# EAGLE design sensorfix (EAGLE 7.1.0)
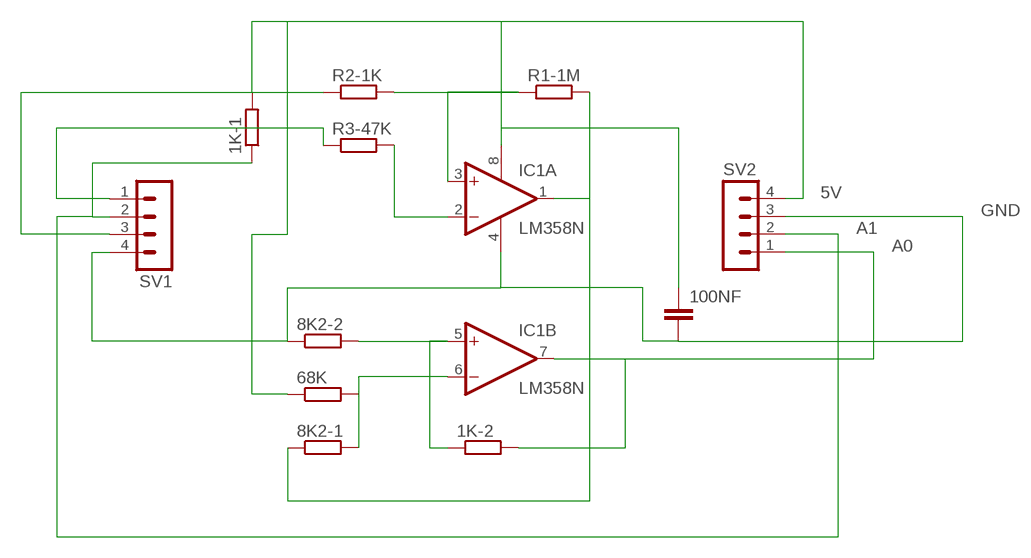
[diagram p0: schematic, sheet 1]

## Parts
1K-1  R-EU_0309/12  [0309/12]
1K-2  R-EU_0309/12  [0309/12]
8K2-1  R-EU_0309/12  [0309/12]
8K2-2  R-EU_0309/12  [0309/12]
68K  R-EU_0309/12  [0309/12]
100NF  C2.5/6  [C2.5-6]
IC1  LM358N  [DIL08]
R1-1M  R-EU_0309/12  [0309/12]
R2-1K  R-EU_0309/12  [0309/12]
R3-47K  R-EU_0309/12  [0309/12]
SV1  MA04-1  [MA04-1]
SV2  MA04-1  [MA04-1]

## Nets
5V: 1K-1.2 68K.1 100NF.1 IC1.8(P:V+) SV2.4
A0: 1K-2.2 IC1.7(B:OUT) SV2.1
A1: 1K-1.1 SV1.2 SV2.2
GND: 8K2-2.1 100NF.2 IC1.4(P:V-) SV1.4 SV2.3
N$1: IC1.3(A:+IN) R1-1M.1 R2-1K.2
N$2: 8K2-1.1 IC1.1(A:OUT) R1-1M.2
N$3: IC1.2(A:-IN) R3-47K.2
N$4: 1K-2.1 8K2-2.2 IC1.5(B:+IN)
N$5: 8K2-1.2 68K.2 IC1.6(B:-IN)
N$7: R3-47K.1 SV1.1
N$8: R2-1K.1 SV1.3

## Library data of the parts
1K-1 1K-2 8K2-1 8K2-2 68K R1-1M R2-1K R3-47K = rcl:R-EU_: RESISTOR, European symbol
100NF = capacitor-wima:C: CAPACITOR naming: grid - package width
IC1 = linear:LM358: OP AMP also LM158; LM258; LM2904 Source: http://cache.national.com/ds/LM/LM158.pdf
SV1 SV2 = con-lstb:MA04-1: PIN HEADER; OC_FARNELL: unknown; OC_NEWARK: unknown

## Board
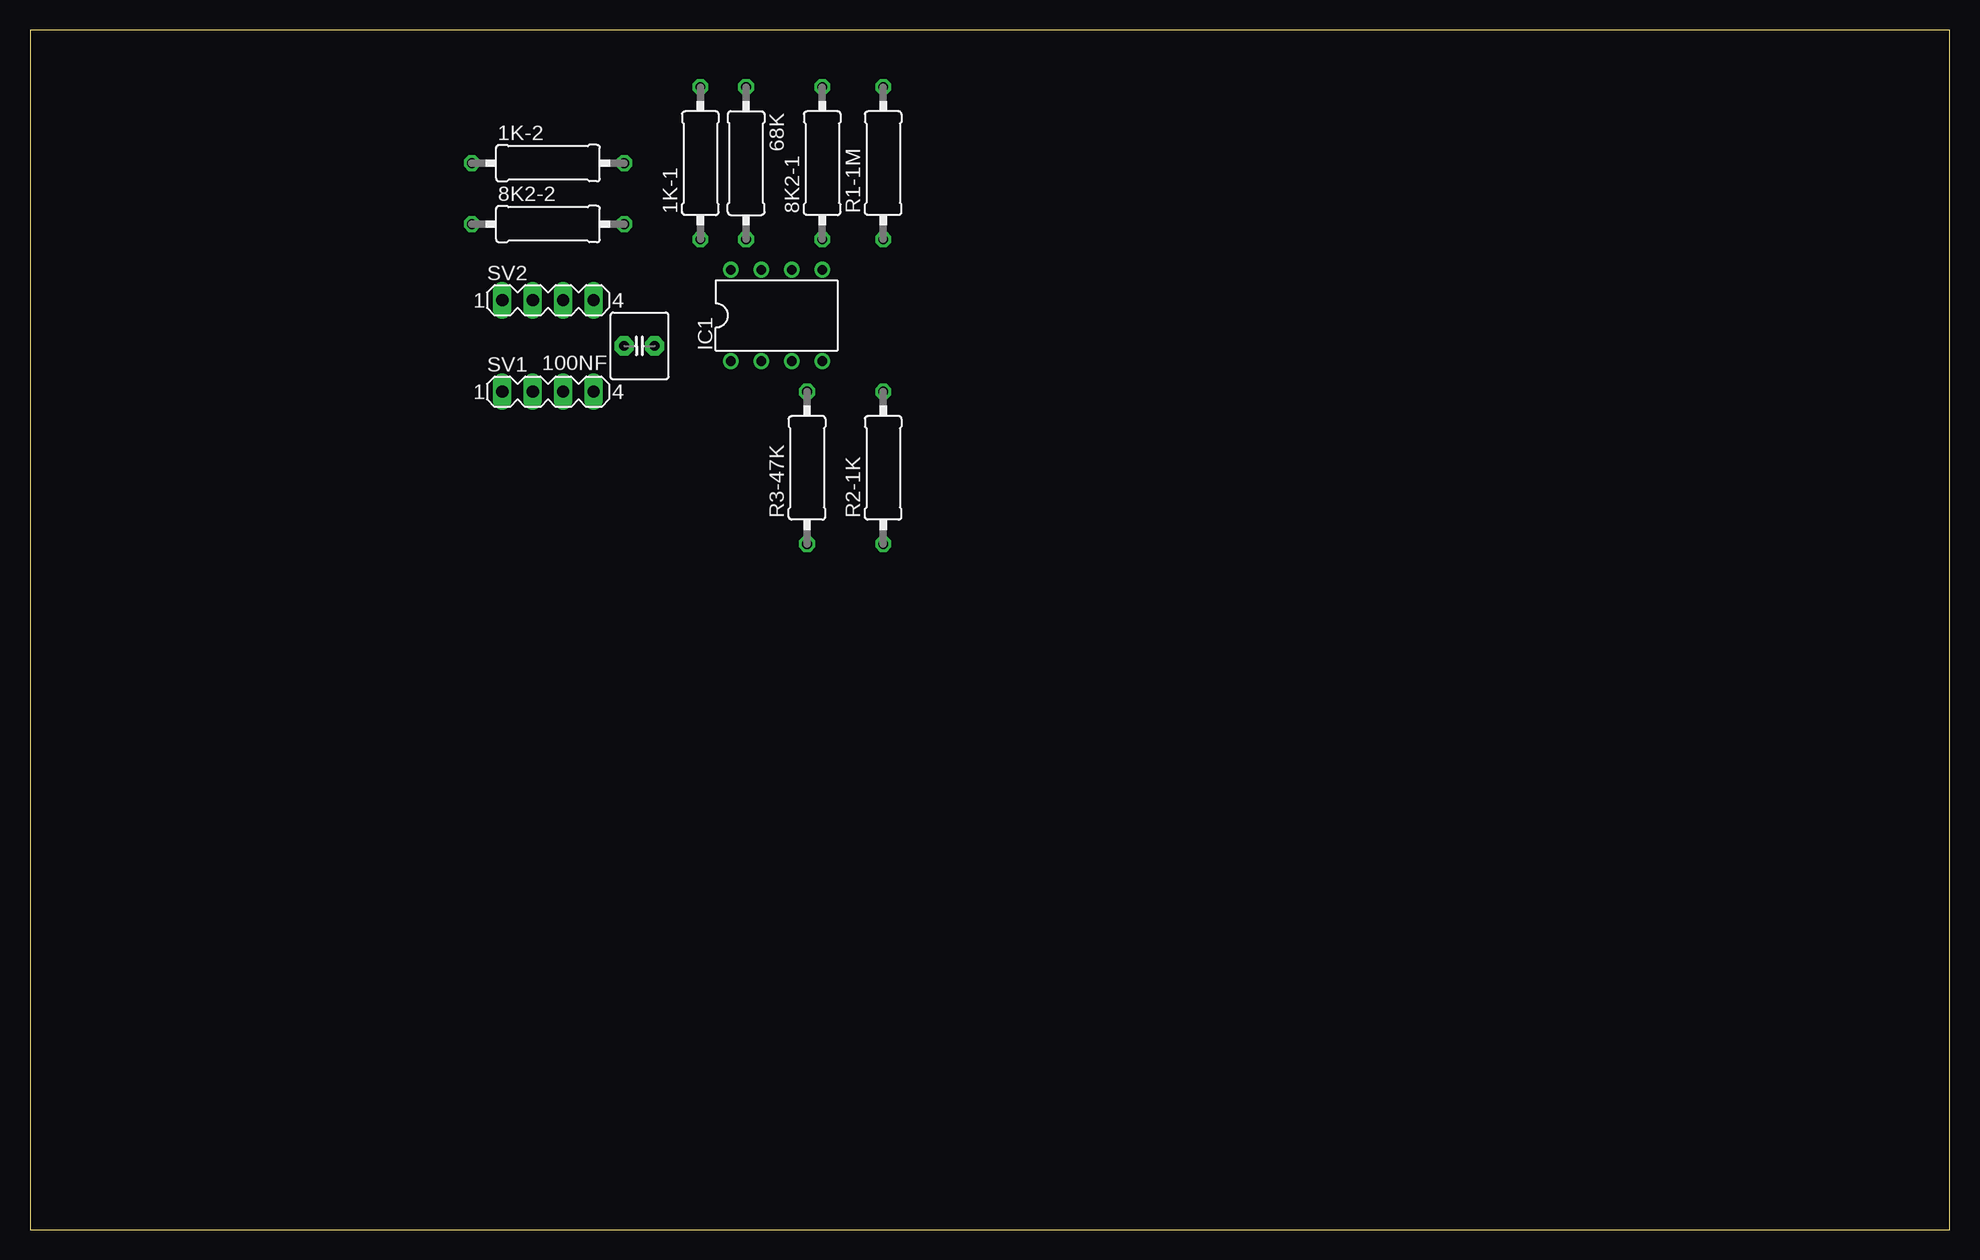
[diagram p1: board, top side]
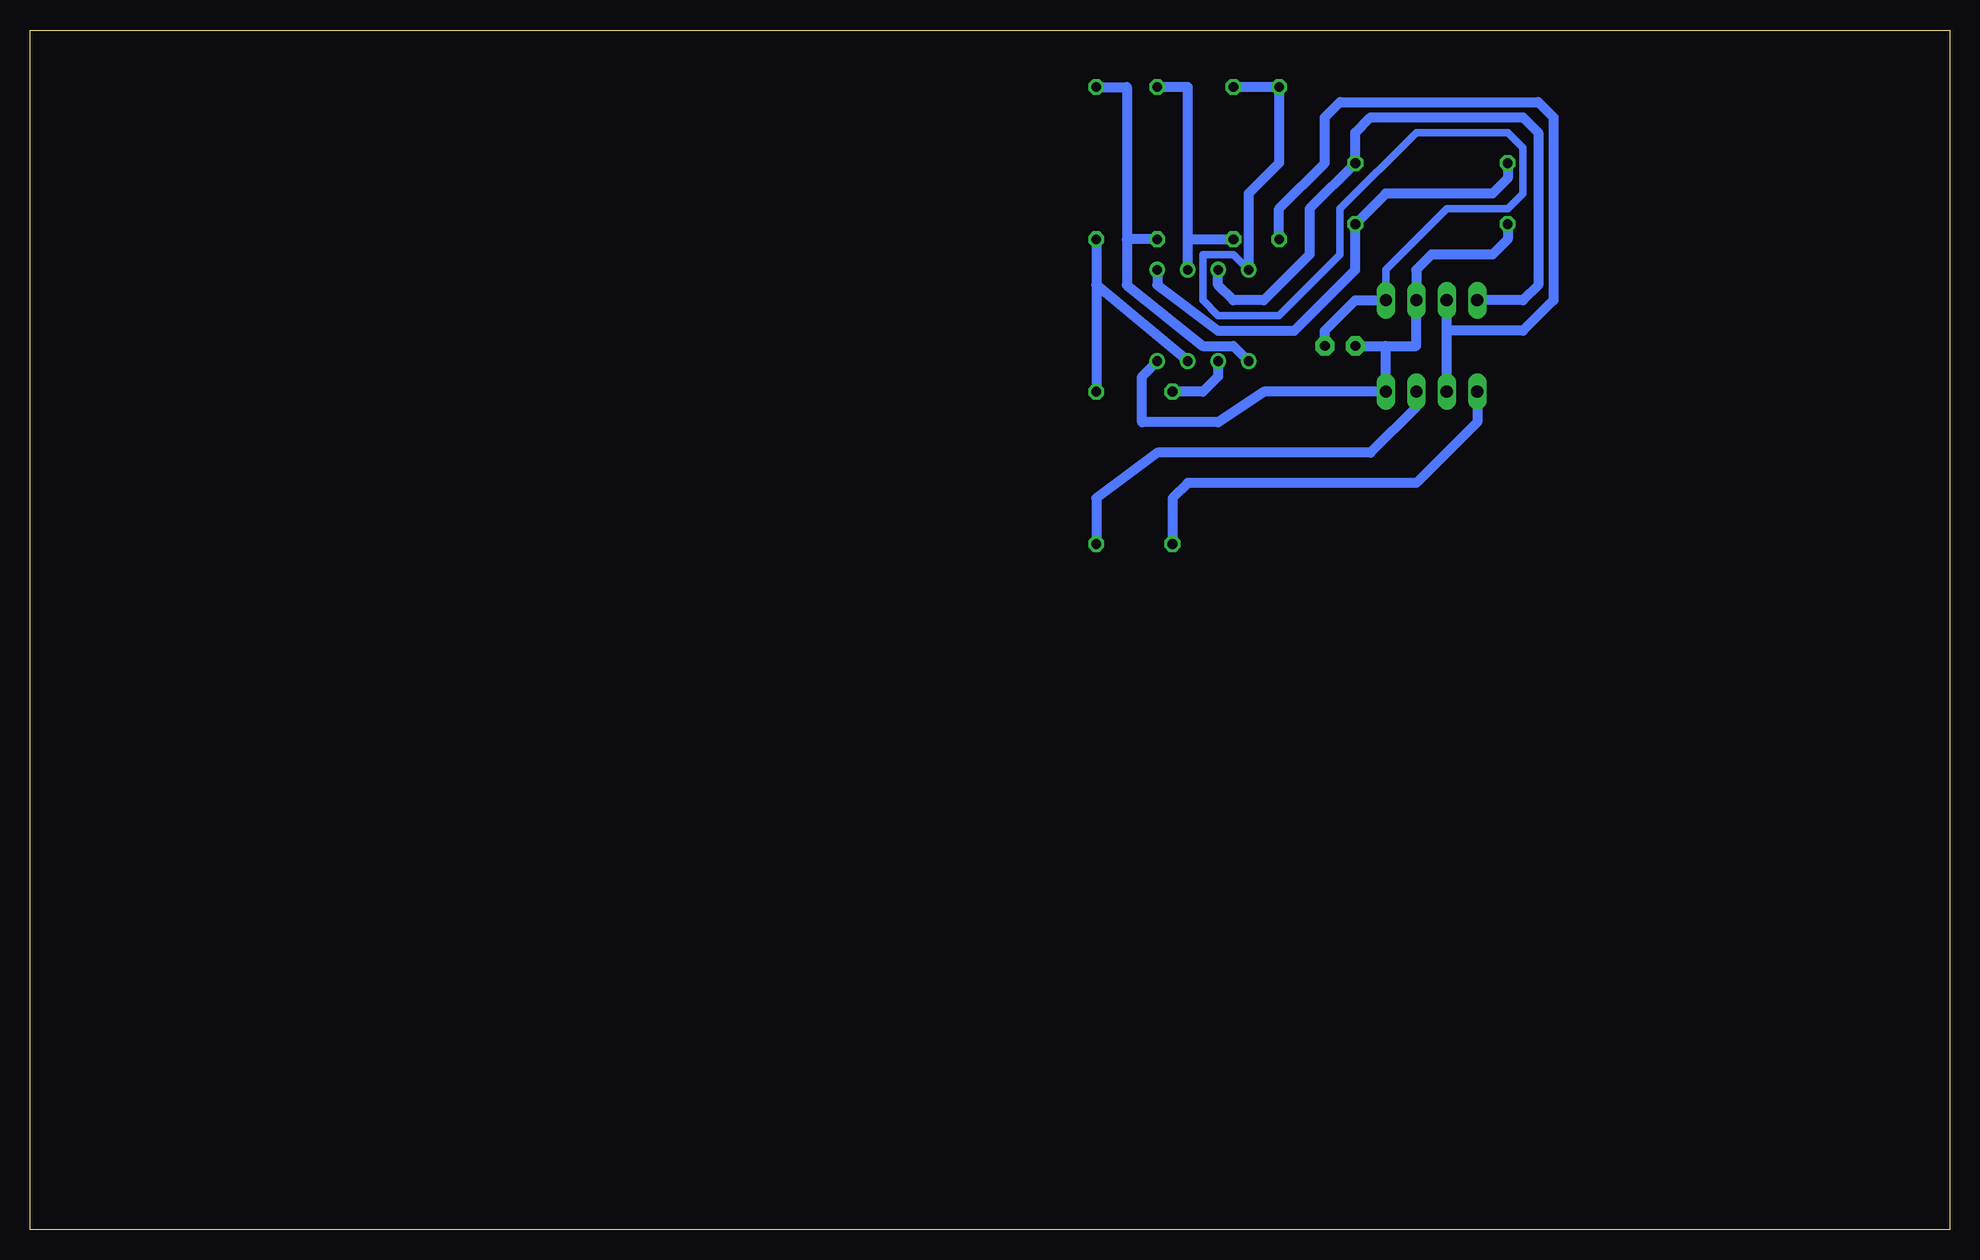
[diagram p2: board, bottom side, seen from below]

Size 160 x 100 mm. Coordinates in mm from the lower left corner, seen from the top.
Outline: 0,0 160,0 160,100 0,100 0,0
Copper layers (1*16): Top 0.035mm / dielectric 1.5mm / Bottom 0.035mm
Design rules "default": minimum track width 10mil, minimum drill 24mil, track to track 8mil, track to pad 8mil, pad to pad 8mil, via to via 8mil, smd to smd 8mil, copper to edge 40mil, drill to drill 8mil, minimum pad ring 10mil, minimum via ring 8mil, stop-mask expansion 4mil, vias tented up to drill 0mil, thermal gap 10mil

### Footprints (pad centres in the part's own frame; a part is rotated, then mirrored left to right if it is on the bottom)
0309/12 = drill 0.813 octagon: 1 -6.35,0; 2 6.35,0
C2.5-6 = drill 0.813 pad 1.6 octagon: 1 -1.27,0; 2 1.27,0
DIL08 = drill 0.813 pad 1.27: 1 -3.81,-3.81; 2 -1.27,-3.81; 3 1.27,-3.81; 4 3.81,-3.81; 5 3.81,3.81; 6 1.27,3.81; 7 -1.27,3.81; 8 -3.81,3.81
MA04-1 = drill 1.016 long: 1 -3.81,0; 2 -1.27,0; 3 1.27,0; 4 3.81,0

### Placement (x,y rotation side)
1K-1  55.88,88.9 90 top
1K-2  43.18,88.9 0 top
8K2-1  66.04,88.9 90 top
8K2-2  43.18,83.82 0 top
68K  59.69,88.9 270 top
100NF  50.8,73.66 180 top
IC1  62.23,76.2 0 top
R1-1M  71.12,88.9 90 top
R2-1K  71.12,63.5 90 top
R3-47K  64.77,63.5 90 top
SV1  43.18,69.85 0 top
SV2  43.18,77.47 0 top

### Tracks (layer width: path | path; a pad name or v marks a point on that pad's centre or on a via)
5V
  Bottom 0.61: IC1.8 59.69,81.28 62.23,81.28 62.23,77.47 60.96,76.2 55.88,76.2 50.8,81.28 50.8,85.09 44.45,91.44 36.83,91.44 35.56,90.17 35.56,86.36 36.83,85.09 41.91,85.09 46.99,80.01 SV2.4
  Bottom 0.813: 68K.1 1K-1.2 55.88,88.9 58.42,86.36 IC1.8 | 100NF.1 52.07,74.93 49.53,77.47 SV2.4
A0
  Bottom 0.813: SV2.1 35.56,77.47 34.29,78.74 34.29,91.44 35.56,92.71 48.26,92.71 49.53,91.44 1K-2.2 53.34,85.09 53.34,81.28 57.15,77.47 59.69,77.47 60.96,78.74 IC1.7
A1
  Bottom 0.813: 1K-1.1 55.88,85.09 52.07,88.9 52.07,92.71 50.8,93.98 34.29,93.98 33.02,92.71 33.02,77.47 35.56,74.93 41.91,74.93 | SV1.2 41.91,74.93 | 41.91,74.93 SV2.2
GND
  Bottom 0.813: 8K2-2.1 36.83,82.55 38.1,81.28 43.18,81.28 44.45,80.01 SV2.3 44.45,73.66 46.99,73.66 | IC1.4 67.31,71.12 67.31,67.31 60.96,67.31 57.15,69.85 SV1.4 46.99,73.66 | 100NF.2 46.99,73.66
N$1
  Bottom 0.813: R1-1M.1 71.12,78.74 | 71.12,78.74 R2-1K.2 | IC1.3 71.12,78.74
N$2
  Bottom 0.813: R1-1M.2 68.58,95.25 68.58,82.55 | 8K2-1.1 68.58,82.55 | 68.58,82.55 68.58,78.74 62.23,73.66 59.69,73.66 IC1.1
N$3
  Bottom 0.813: IC1.2 60.96,71.12 62.23,69.85 R3-47K.2
N$4
  Bottom 0.813: 1K-2.1 36.83,87.63 38.1,86.36 46.99,86.36 8K2-2.2 49.53,80.01 54.61,74.93 60.96,74.93 66.04,78.74 IC1.5
N$5
  Bottom 0.813: 63.5,82.55 63.5,95.25 8K2-1.2 | IC1.6 63.5,82.55 | 63.5,82.55 68K.2
N$7
  Bottom 0.813: SV1.1 39.37,67.31 44.45,62.23 63.5,62.23 64.77,60.96 R3-47K.1
N$8
  Bottom 0.813: SV1.3 44.45,68.58 48.26,64.77 66.04,64.77 71.12,60.96 R2-1K.1